# EAGLE design Load_Sig_Sch (EAGLE 6.4)
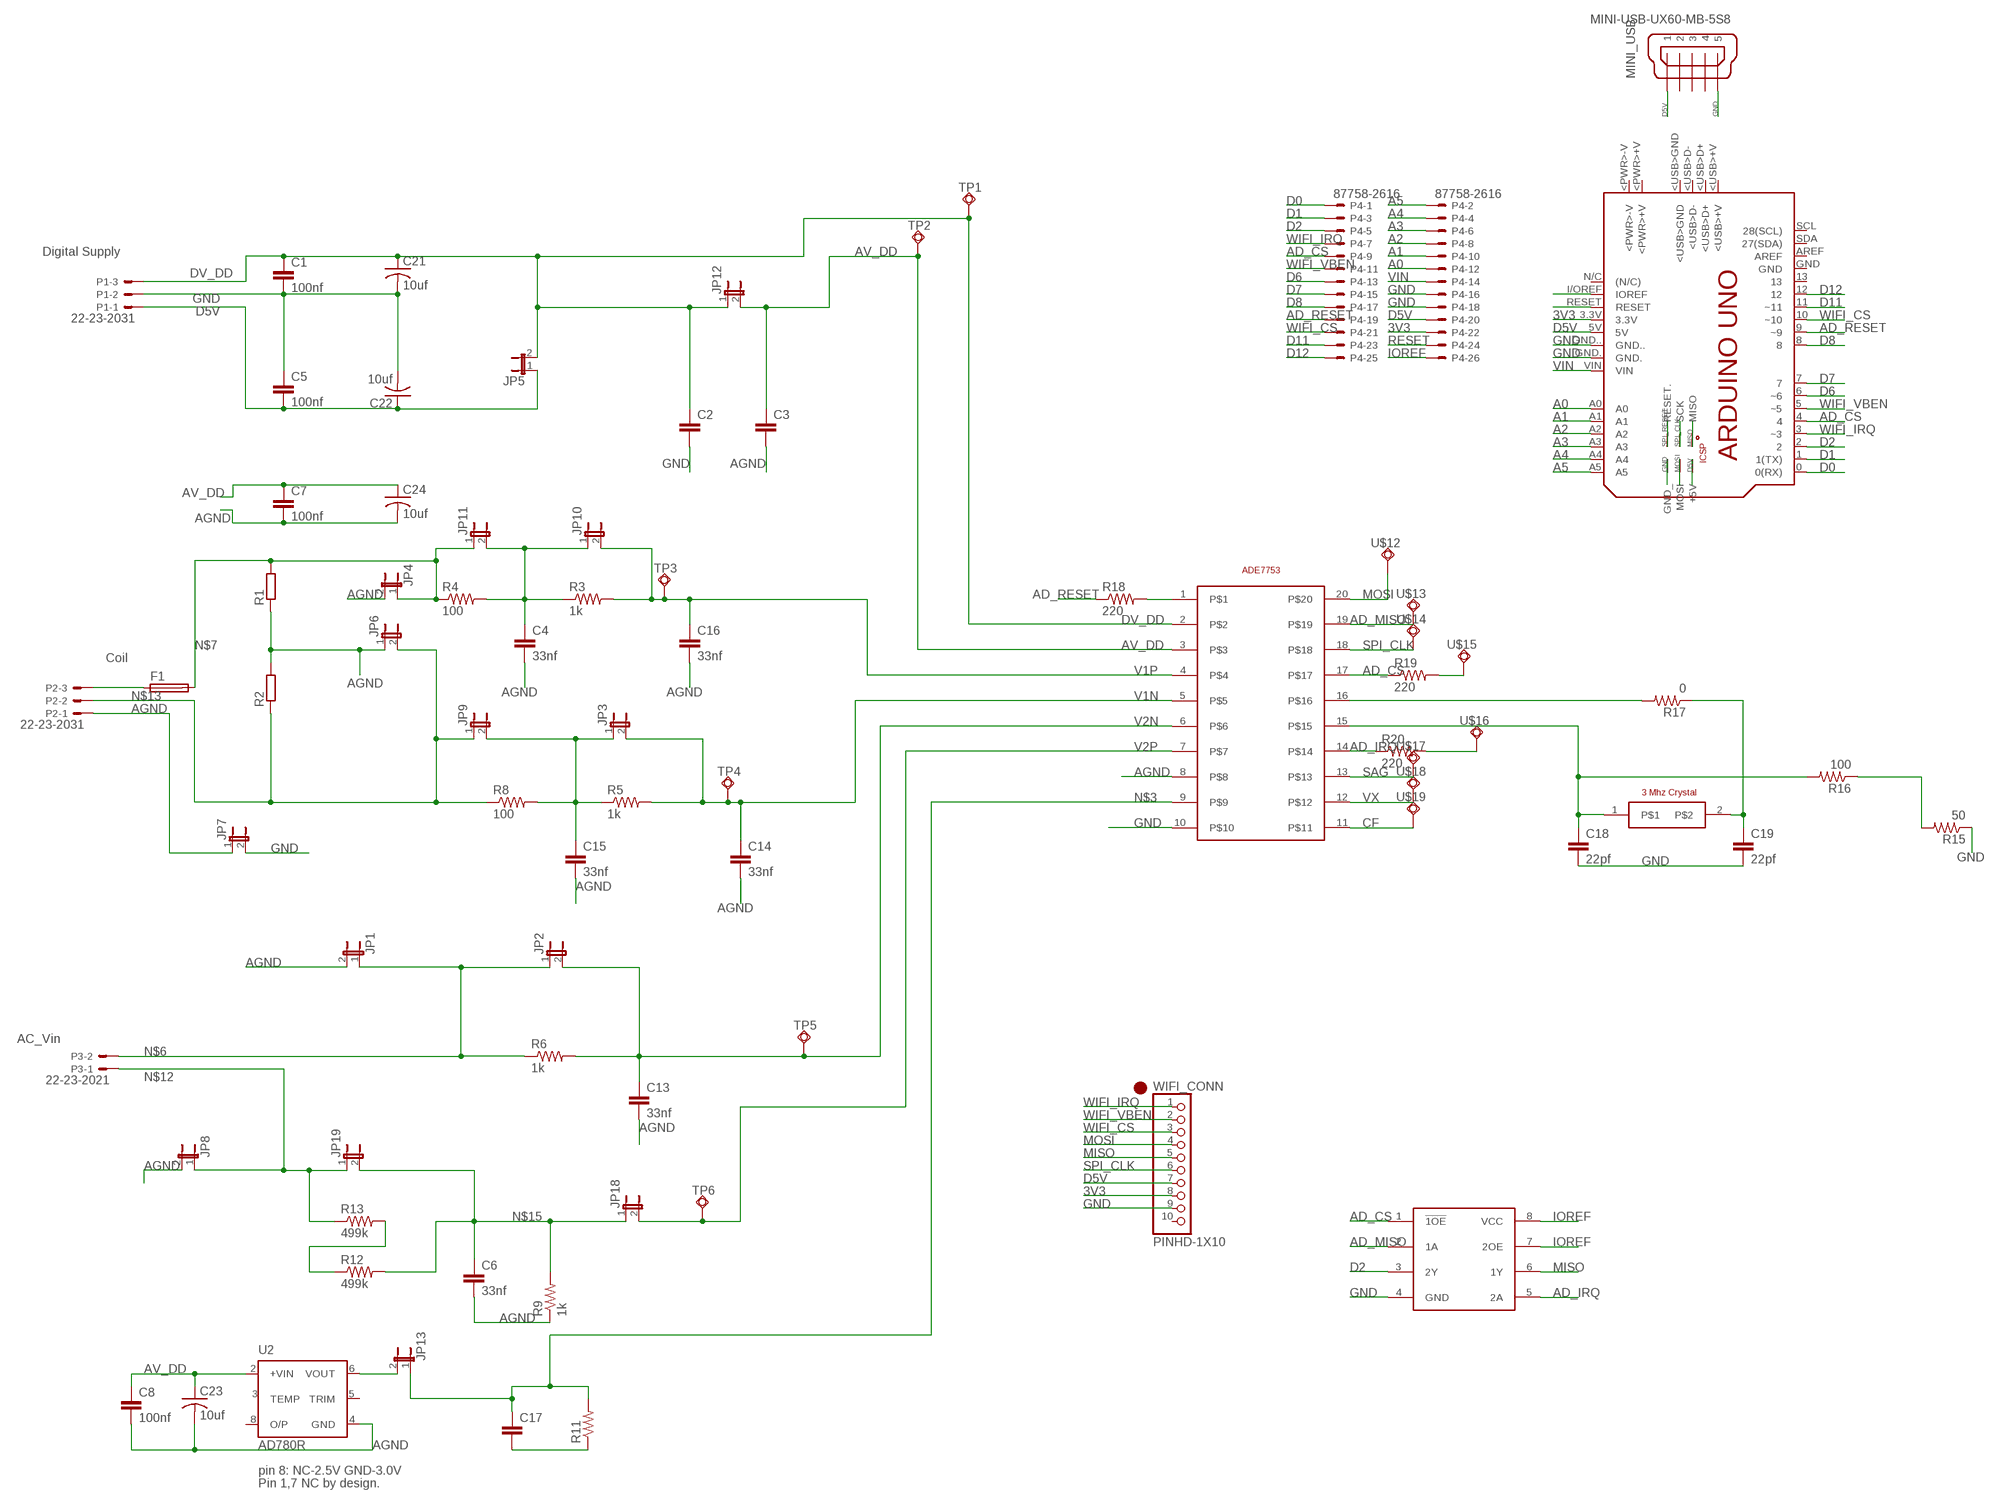
[diagram p0: schematic, sheet 1]

## Parts
C1  100nf  C-EU025-024X044  [C025-024X044]
C2  C-EU025-024X044  [C025-024X044]
C3  C-EU025-024X044  [C025-024X044]
C4  33nf  C-EU025-024X044  [C025-024X044]
C5  100nf  C-EU025-024X044  [C025-024X044]
C6  33nf  C-EU025-024X044  [C025-024X044]
C7  100nf  C-EU025-024X044  [C025-024X044]
C8  100nf  C-EU025-024X044  [C025-024X044]
C13  33nf  C-EU025-024X044  [C025-024X044]
C14  33nf  C-EU025-024X044  [C025-024X044]
C15  33nf  C-EU025-024X044  [C025-024X044]
C16  33nf  C-EU025-024X044  [C025-024X044]
C17  C-EU025-024X044  [C025-024X044]
C18  22pf  C-EU025-024X044  [C025-024X044]
C19  22pf  C-EU025-024X044  [C025-024X044]
C21  10uf  C-US025-024X044  [C025-024X044]
C22  10uf  C-US025-024X044  [C025-024X044]
C23  10uf  C-US025-024X044  [C025-024X044]
C24  10uf  C-US025-024X044  [C025-024X044]
F1  19560  [19560]
JP1  JP1E  [JP1]
JP2  JP1E  [JP1]
JP3  JP1E  [JP1]
JP4  JP1E  [JP1]
JP5  JP1E  [JP1]
JP6  JP1E  [JP1]
JP7  JP1E  [JP1]
JP8  JP1E  [JP1]
JP9  JP1E  [JP1]
JP10  JP1E  [JP1]
JP11  JP1E  [JP1]
JP12  JP1E  [JP1]
JP13  JP1E  [JP1]
JP18  JP1E  [JP1]
JP19  JP1E  [JP1]
MINI_USB  MINI-USB-UX60-MB-5S8  [UX60-MB-5S8]
P1  22-23-2031  [22-23-2031]
P2  22-23-2031  [22-23-2031]
P3  22-23-2021  [22-23-2021]
P4  87758-2616  [87758-2616]
PCB1  ARDUINO_UNO  [ARDUINO_UNO]
R1  BVS  [BVS]
R2  BVS  [BVS]
R3  1k  R-US_0204/2V  [0204V]
R4  100  R-US_0204/2V  [0204V]
R5  1k  R-US_0204/2V  [0204V]
R6  1k  R-US_0204/2V  [0204V]
R8  100  R-US_0204/2V  [0204V]
R9  1k  R-US_0204/2V  [0204V]
R11  R-US_0204/2V  [0204V]
R12  499k  R-US_0204/2V  [0204V]
R13  499k  R-US_0204/2V  [0204V]
R15  50  R-US_0204/2V  [0204V]
R16  100  R-US_0204/2V  [0204V]
R17  0  R-US_0204/2V  [0204V]
R18  220  RESISTOR0603-RES  [0603-RES]
R19  220  RESISTOR0603-RES  [0603-RES]
R20  220  RESISTOR0603-RES  [0603-RES]
TP1  TEST  [TEST]
TP2  TEST  [TEST]
TP3  TEST  [TEST]
TP4  TEST  [TEST]
TP5  TEST  [TEST]
TP6  TEST  [TEST]
U1  ADE7753  [SSOP20]
U2  AD780R  [SO8]
U3  74LVC2G241  [SOP65P490X110-8N]
U$2  X079-ND_CRYSTAL  [HC49US]
U$12  TEST  [TEST]
U$13  TEST  [TEST]
U$14  TEST  [TEST]
U$15  TEST  [TEST]
U$16  TEST  [TEST]
U$17  TEST  [TEST]
U$18  TEST  [TEST]
U$19  TEST  [TEST]
WIFI_CONN  PINHD-1X10  [1X10-BIG]

## Nets
3V3: P4.22 PCB1.3.3V WIFI_CONN.8
A0: P4.12 PCB1.A0
A1: P4.10 PCB1.A1
A2: P4.8 PCB1.A2
A3: P4.6 PCB1.A3
A4: P4.4 PCB1.A4
A5: P4.2 PCB1.A5
AD_CS: P4.9 PCB1.4 R19.1 U1.17 U3.1(!1OE)
AD_IRQ: R20.1 U1.14 U3.5(2A)
AD_MISO: U1.19 U3.2(1A) U$13.1
AD_RESET: P4.19 PCB1.9(~9) R18.1
AGND: C3.2 C4.2 C6.2 C7.2 C8.2 C13.2 C14.2 C15.2 C16.2 C23.2 C24.2 JP1.2 JP4.2 JP6.1 JP7.1 JP8.2 P2.1 R1.2 R2.1 R9.1 U1.8 U2.4(GND)
AV_DD: C3.1 C7.1 C8.1 C23.1 C24.1 JP12.2 TP2.1 U1.3 U2.2(+VIN)
CF: U1.11 U$19.1
D0: P4.1 PCB1.0(0(RX))
D1: P4.3 PCB1.1(1(TX))
D2: P4.5 PCB1.2 U3.3(2Y)
D5V: C5.2 C22.1 JP5.1 MINI_USB.1 P1.1 P4.20 PCB1.5V PCB1.+5V WIFI_CONN.7
D6: P4.13 PCB1.6(~6)
D7: P4.15 PCB1.7
D8: P4.17 PCB1.8
D11: P4.23 PCB1.11(~11)
D12: P4.25 PCB1.12
DV_DD: C1.1 C2.1 C21.1 JP5.2 JP12.1 P1.3 TP1.1 U1.2
GND: C1.2 C2.2 C5.1 C18.2 C19.2 C21.2 C22.2 JP7.2 MINI_USB.5 P1.2 P4.16 P4.18 PCB1.GND. PCB1.GND.. PCB1.GND_ R15.1 U1.10 U3.4(GND) WIFI_CONN.9
IOREF: P4.26 PCB1.I/OREF(IOREF) U3.7(2OE) U3.8(VCC)
MISO: PCB1.MISO U3.6(1Y) WIFI_CONN.5
MOSI: PCB1.MOSI U1.20 U$12.1 WIFI_CONN.4
N$1: F1.1 P2.3
N$3: C17.1 JP13.1 R11.2 U1.9
N$4: C18.1 R16.2 U1.15 U$2.1
N$5: C19.1 R17.1 U$2.2
N$6: JP1.1 JP2.1 P3.2 R6.1
N$7: F1.2 JP4.1 JP11.1 R1.1 R4.1
N$8: C4.1 JP10.1 JP11.2 R3.1 R4.2
N$9: R15.2 R16.1
N$10: C15.1 JP3.1 JP9.2 R5.1 R8.2
N$12: JP8.1 JP19.1 P3.1 R13.1
N$13: JP6.2 JP9.1 P2.2 R2.2 R8.1
N$14: R17.2 U1.16
N$15: C6.1 JP18.1 JP19.2 R9.2 R12.2
N$16: R12.1 R13.2
N$19: JP13.2 U2.6(VOUT)
N$20: C17.2 R11.1
N$21: R19.2 U$15.1
N$22: R20.2 U$16.1
RESET: P4.24 PCB1.RESET
RESETBIN: R18.2 U1.1
SAG: U1.13 U$17.1
SPI_CLK: PCB1.SCK U1.18 U$14.1 WIFI_CONN.6
SPI_RESET: PCB1.RESET.
V1N: C14.1 JP3.2 R5.2 TP4.1 U1.5
V1P: C16.1 JP10.2 R3.2 TP3.1 U1.4
V2N: C13.1 JP2.2 R6.2 TP5.1 U1.6
V2P: JP18.2 TP6.1 U1.7
VIN: P4.14 PCB1.VIN
VX: U1.12 U$18.1
WIFI_CS: P4.21 PCB1.10(~10) WIFI_CONN.3
WIFI_IRQ: P4.7 PCB1.3(~3) WIFI_CONN.1
WIFI_VBEN: P4.11 PCB1.5(~5) WIFI_CONN.2
Unconnected: MINI_USB.2 MINI_USB.3 MINI_USB.4 PCB1.13 PCB1.<PWR>+V PCB1.<PWR>-V PCB1.<USB>+V PCB1.<USB>D+ PCB1.<USB>D- PCB1.<USB>GND PCB1.AREF PCB1.GND PCB1.N/C((N/C)) PCB1.SCL(28(SCL)) PCB1.SDA(27(SDA)) U2.3(TEMP) U2.5(TRIM) U2.8(O/P) WIFI_CONN.10

## Notes on the sheet
- Digital Supply
- Coil
- AC_Vin
- pin 8: NC-2.5V GND-3.0V
- Pin 1,7 NC by design.

## Library data of the parts
C1-C8 C13-C17 = resistor:C-EU: CAPACITOR, European symbol
C18 C19 = rcl:C-EU: CAPACITOR, European symbol
C21-C24 = adafruit:C-US: CAPACITOR, American symbol
F1 = fuse:19560: FUSE HOLDER TR5, Wickmann; MPN: 56000001009; OC_FARNELL: 1185363; OC_NEWARK: 15P8392
JP1-JP13 JP18 JP19 = jumper:JP1E: JUMPER
MINI_USB = con-hirose:MINI-USB-: MINI USB Connector Source: http://www.hirose.co.jp/cataloge_hp/e24000019.pdf; OC_FARNELL: unknown; OC_NEWARK: unknown
P1 P2 = con-molex:22-23-2031: .100" (2.54mm) Center Header - 3 Pin; MF: MOLEX; MPN: 22-23-2031; OC_FARNELL: 1462950; OC_NEWARK: 30C0862
P3 = con-molex:22-23-2021: .100" (2.54mm) Center Header - 2 Pin; MF: MOLEX; MPN: 22-23-2021; OC_FARNELL: 1462926; OC_NEWARK: 25C3832
P4 = con-molex:87758-2616: 26 Pin - 2mm Dual Row Single Wafer, Vertical T/H HDR Source: http://www.molex.com/pdm_docs/sd/877580616_sd.pdf; MPN: 87758-2616; OC_FARNELL: unknown; OC_NEWARK: 94M1541
PCB1 = E14_Arduino_published:ARDUINO_UNO: Device for representing an Arduino Uno board with a footprint in an EAGLE design. Created by Dave Young for Element14. More EAGLE documentation at: http://www.element14.com/community/community/knode/cadsoft_eagle
R1 R2 = resistor-shunt:BVS: SMD SHUNT RESISTOR; OC_FARNELL: unknown; OC_NEWARK: unknown
R3-R6 R8 R9 R11-R13 R15-R17 = adafruit:R-US_: RESISTOR, American symbol
R18-R20 = SparkFun-Passives:RESISTOR: Resistor Basic schematic elements and footprints for 0603, 1206, and PTH resistors.
TP1-TP6 U$12-U$19 = CALPLUG:TEST
U1 = untitled:ADE7753
U2 = analog-devices:AD780: High Precision Reference 2.5V/3.0V Source: http://www.analog.com/UploadedFiles/Data_Sheets/AD780.pdf; MPN: AD780BRZ-REEL; OC_FARNELL: 1464655; OC_NEWARK: 12M8938
U3 = 74LVC2G241:74LVC2G241: Tri-state buffer
U$2 = untitled:X079-ND_CRYSTAL
WIFI_CONN = adafruit:PINHD-1X10: Pin header 1x10 0.1" spacing With round pins

## Board
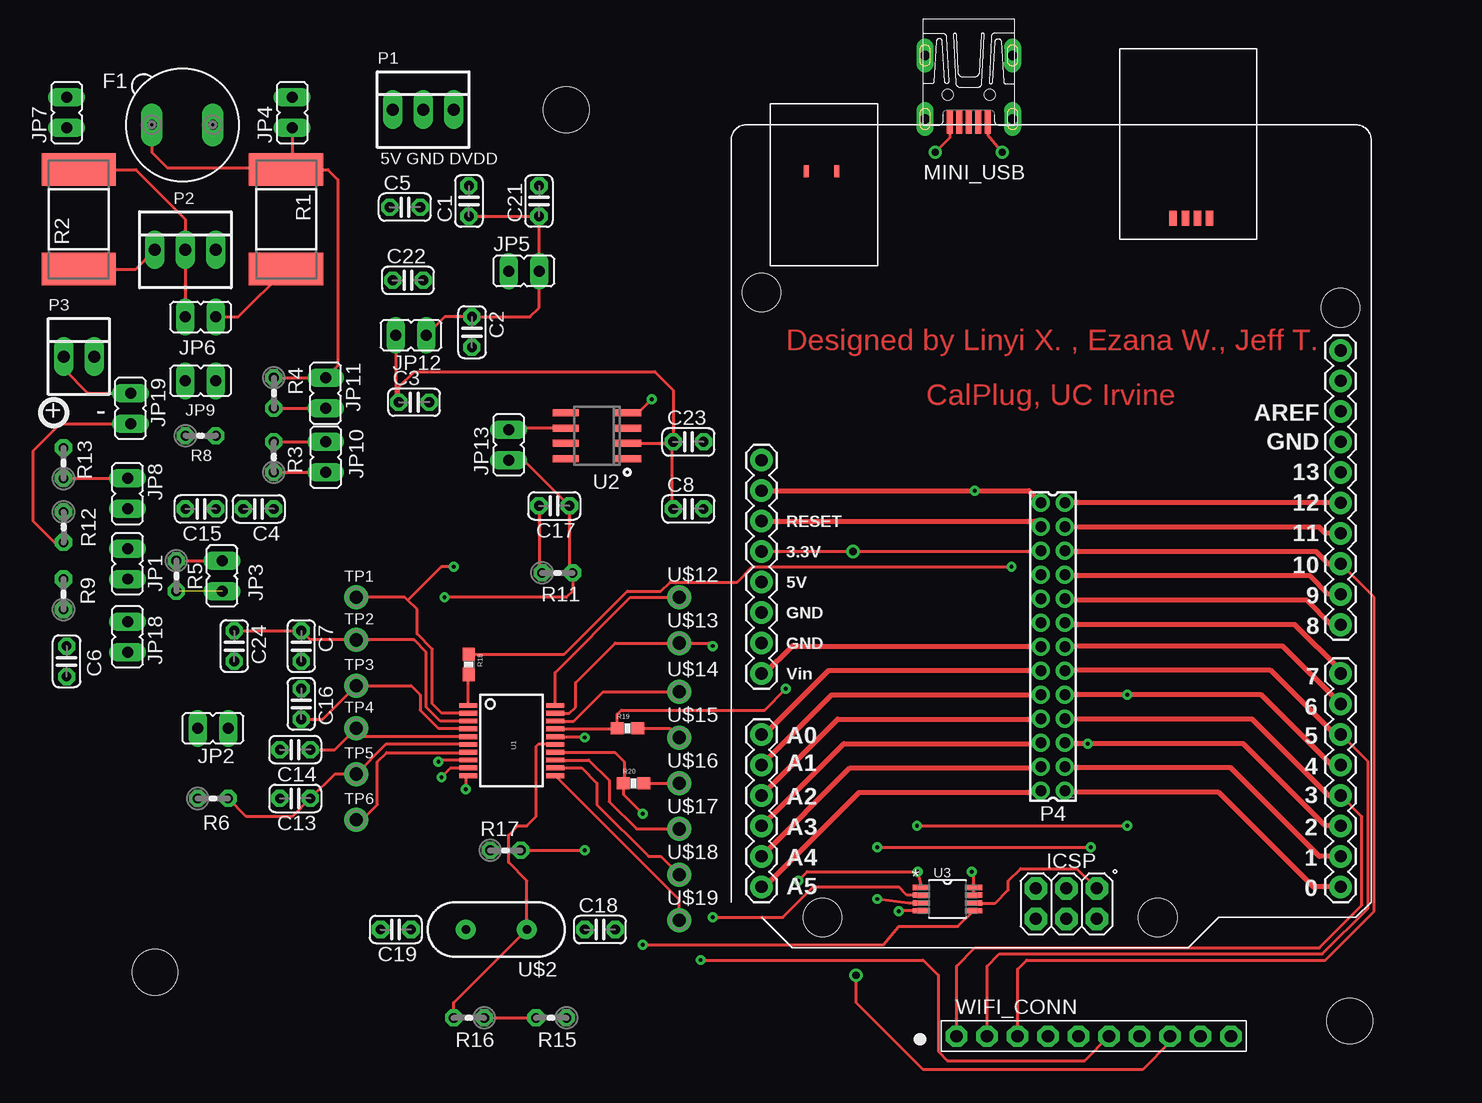
[diagram p1: board, top side]
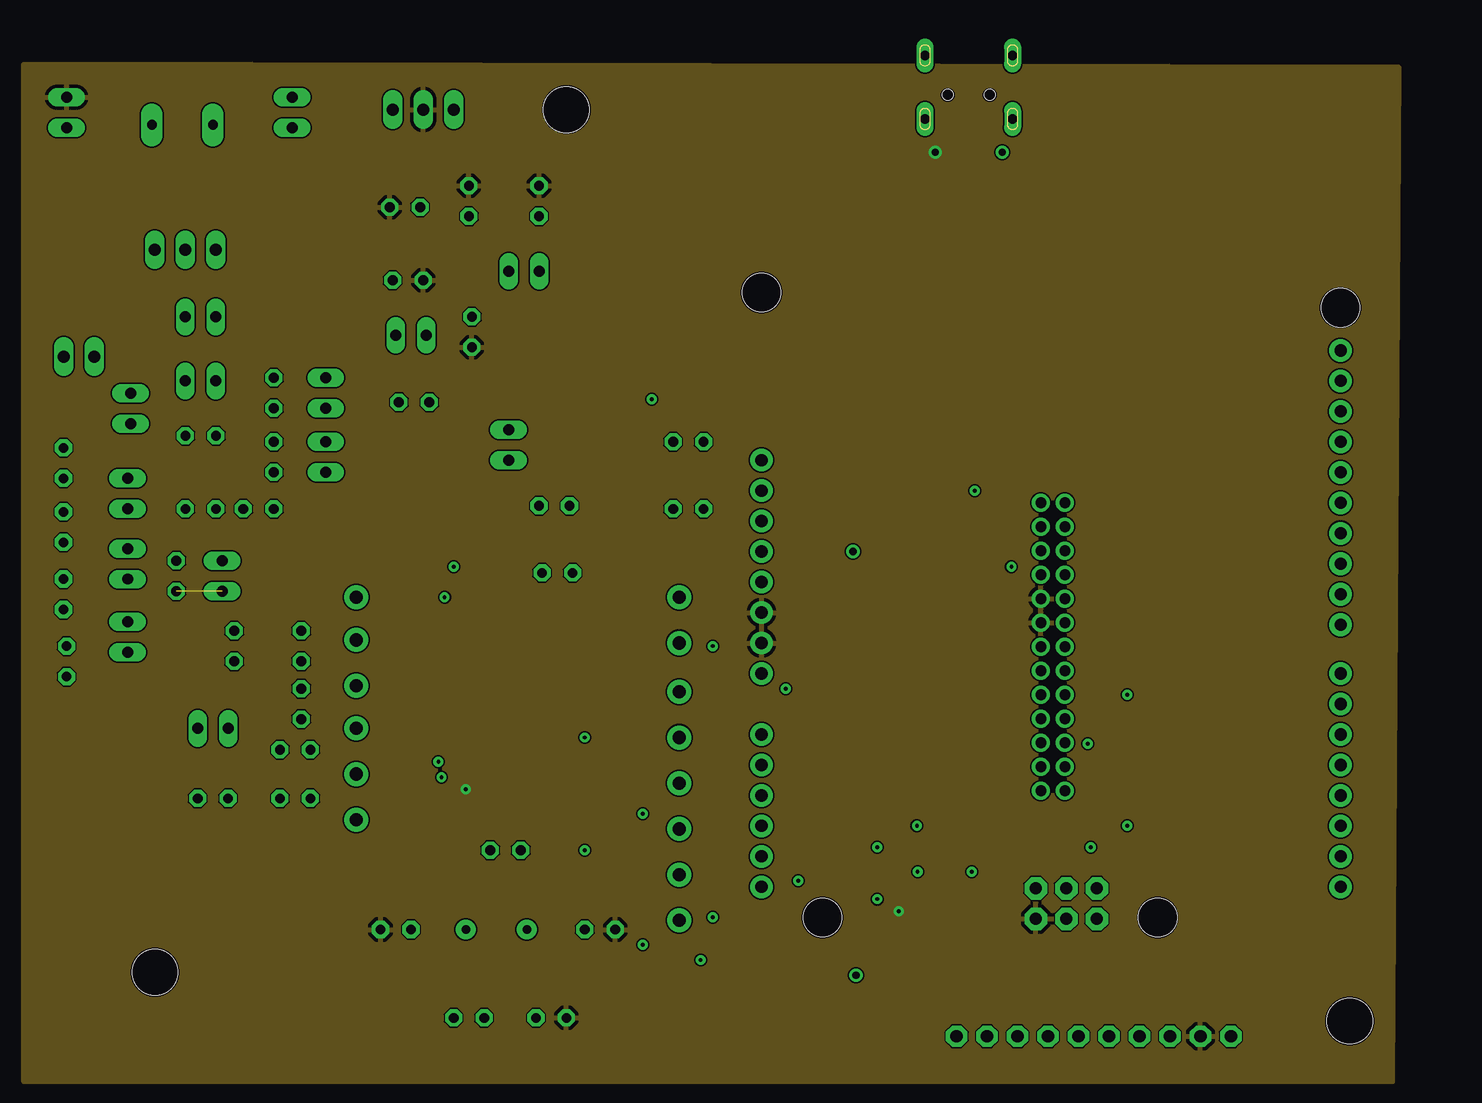
[diagram p2: board, inner layer Route2]
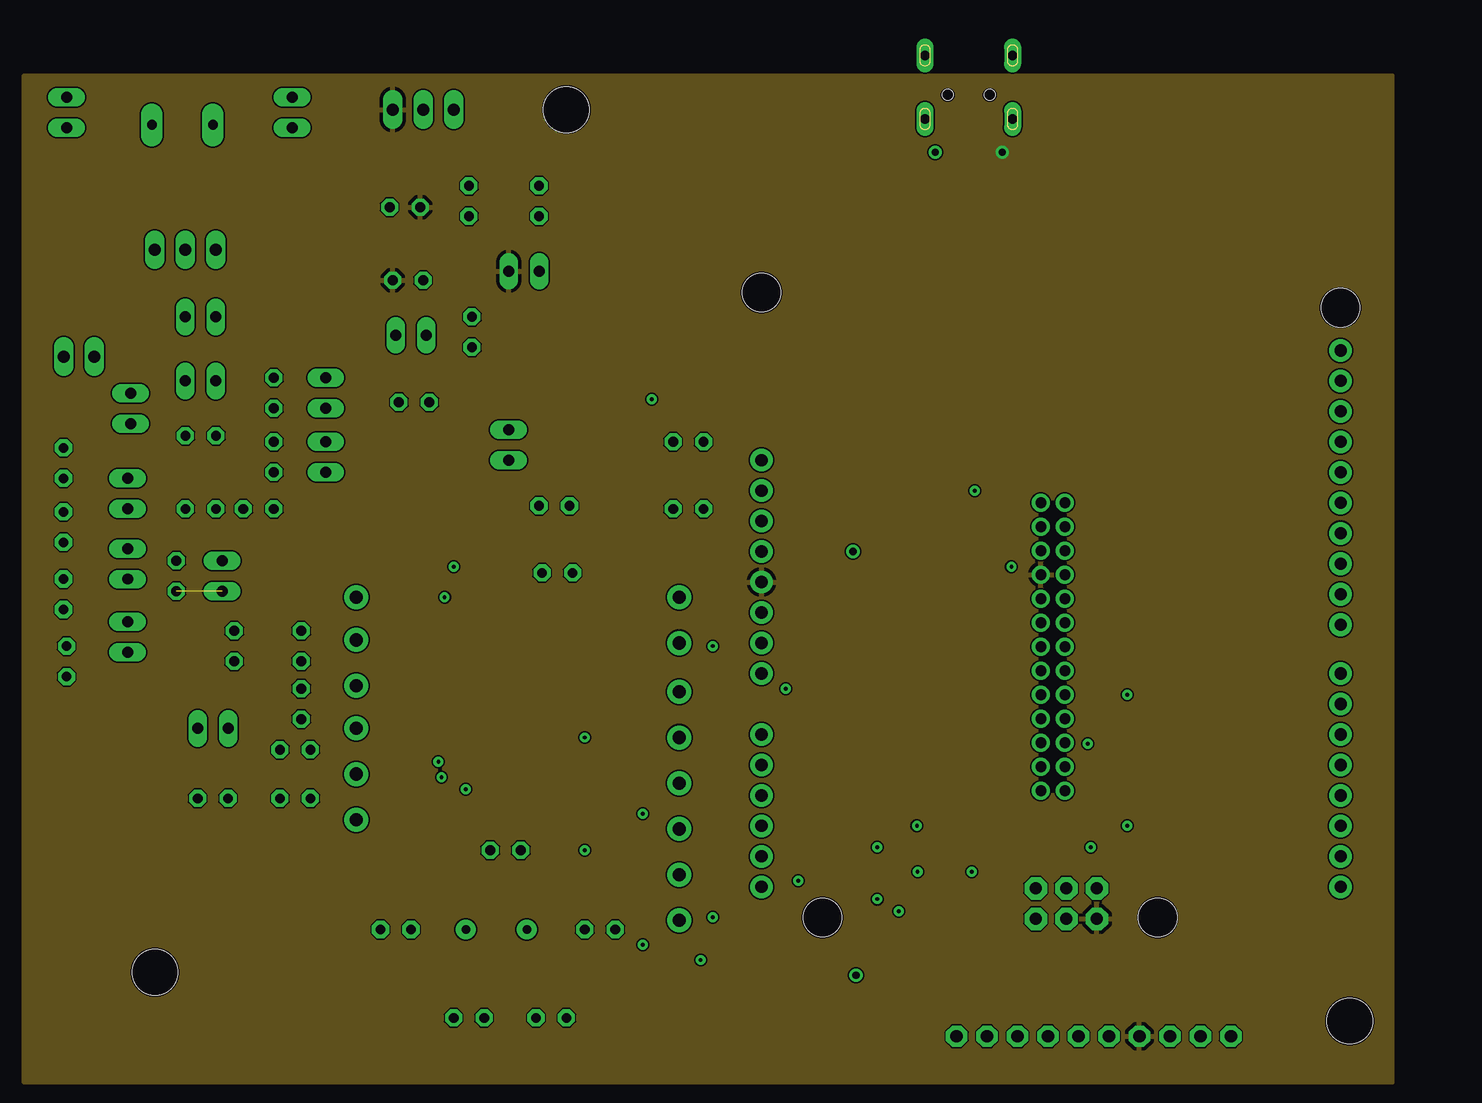
[diagram p3: board, inner layer Route15]
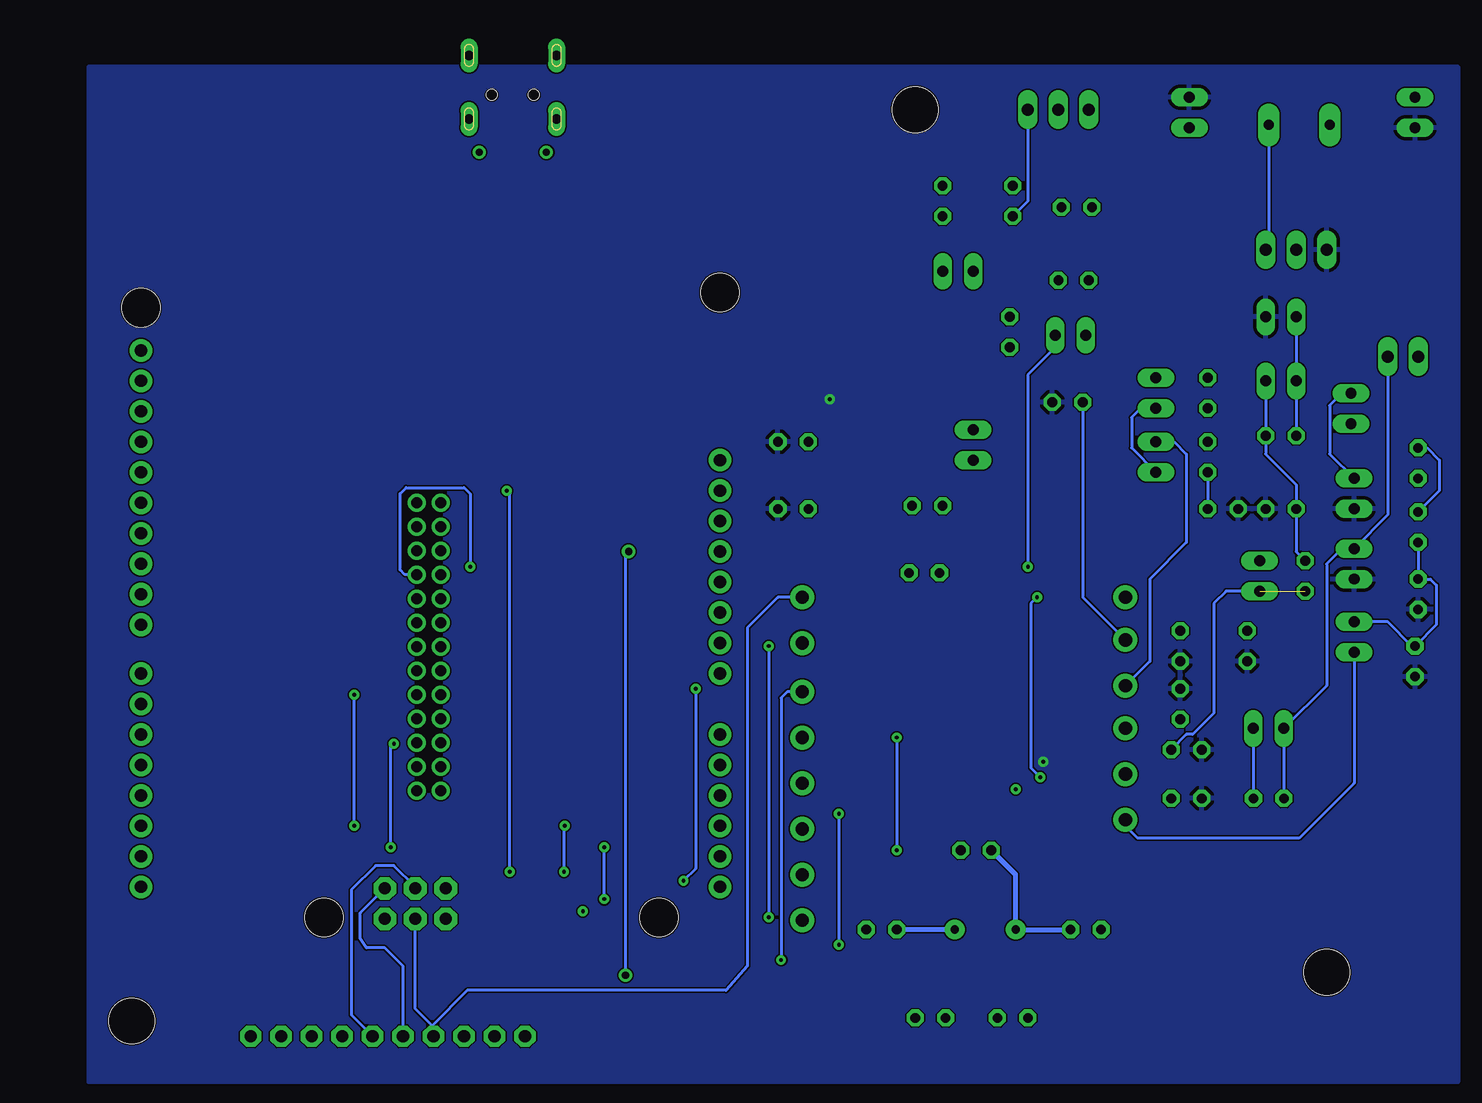
[diagram p4: board, bottom side, seen from below]

No outline drawn. Coordinates in mm, seen from the top.
Copper layers (1*2*15*16): Top 0.035mm / dielectric 1.5mm / Route2 0.035mm / dielectric 0.15mm / Route15 0.035mm / dielectric 0.2mm / Bottom 0.035mm
Design rules "SparkFun-4-layer *": minimum track width 5mil, minimum drill 10mil, track to track 5mil, track to pad 5mil, pad to pad 5mil, via to via 5mil, smd to smd 5mil, copper to edge 5mil, drill to drill 8mil, minimum pad ring 12mil, minimum via ring 10mil, stop-mask expansion 4mil, vias tented up to drill 20mil, thermal gap 12mil
Holes 3.81 mm at 12.45,10.41 112.01,6.35 46.74,82.3

### Footprints (pad centres in the part's own frame; a part is rotated, then mirrored left to right if it is on the bottom)
C025-024X044 = drill 0.813 octagon: 1 -1.27,0; 2 1.27,0
C025-024X044' = drill 0.813 pad 1.422 octagon: 1 -1.27,0; 2 1.27,0
19560 = drill 0.813 pad 1.778 long: 1 -2.54,0; 2 2.54,0
JP1 = drill 0.914 long: 1 0,-1.27; 2 0,1.27
UX60-MB-5S8 = smd 2 x 0.5: 1 8.65,1.6; 2 8.65,0.8; 3 8.65,0; 4 8.65,-0.8; 5 8.65,-1.6 | drill 0.8 long: M1 3.1,-3.65; M2 3.1,3.65; M3 8.4,3.65; M4 8.4,-3.65 | hole 0.9: 6.4,-1.75; 6.4,1.75
22-23-2031 = drill 1 long: 1 -2.54,0; 2 0,0; 3 2.54,0
22-23-2021 = drill 1 long: 1 -1.27,0; 2 1.27,0
87758-2616 = drill 0.9 pad 1.27: 1 -12,-1; 2 -12,1; 3 -10,-1; 4 -10,1; 5 -8,-1; 6 -8,1; 7 -6,-1; 8 -6,1; 9 -4,-1; 10 -4,1; 11 -2,-1; 12 -2,1; 13 0,-1; 14 0,1; 15 2,-1; 16 2,1; 17 4,-1; 18 4,1; 19 6,-1; 20 6,1; 21 8,-1; 22 8,1; 23 10,-1; 24 10,1; 25 12,-1; 26 12,1
ARDUINO_UNO = drill 1.016 pad 1.88: 0 63.5,50.8; 1 60.96,50.8; 2 58.42,50.8; 3 55.88,50.8; 3.3V 35.56,2.54; 4 53.34,50.8; 5 50.8,50.8; 5V 38.1,2.54; 6 48.26,50.8; 7 45.72,50.8; 8 41.656,50.8; 9 39.116,50.8; 10 36.576,50.8; 11 34.036,50.8; 12 31.496,50.8; 13 28.956,50.8; A0 50.8,2.54; A1 53.34,2.54; A2 55.88,2.54; A3 58.42,2.54; A4 60.96,2.54; A5 63.5,2.54; AREF 23.876,50.8; GND 26.416,50.8; GND. 43.18,2.54; GND.. 40.64,2.54; I/OREF 30.48,2.54; N/C 27.94,2.54; RESET 33.02,2.54; SCL 18.796,50.8; SDA 21.336,50.8; VIN 45.72,2.54 | drill 1.016 pad 1.88 octagon: +5V 66.167,30.48; GND_ 66.167,25.4; MISO 63.627,30.48; MOSI 66.167,27.94; RESET. 63.627,25.4; SCK 63.627,27.94 | smd 1.016 x 0.508: <PWR>+V 3.861,8.814; <PWR>-V 3.861,6.274 | smd 1.27 x 0.635: <USB>+V 7.772,39.878; <USB>D+ 7.772,38.887; <USB>D- 7.772,37.871; <USB>GND 7.772,36.83 | hole 3.2: 66.04,7.62; 66.04,35.56; 15.24,50.8; 13.97,2.54
BVS = smd 2.7 x 6.2: 1 -4.14,0; 2 4.14,0
0204V = drill 0.813 octagon: 1 -1.27,0; 2 1.27,0
0603-RES = smd 1.1 x 1: 1 -0.85,0; 2 0.85,0
TEST = drill 1.1 pad 2: 1 0,0
SSOP20 = smd 0.4 x 1.5: 1 -2.925,-3.625; 2 -2.275,-3.625; 3 -1.625,-3.625; 4 -0.975,-3.625; 5 -0.325,-3.625; 6 0.325,-3.625; 7 0.975,-3.625; 8 1.625,-3.625; 9 2.275,-3.625; 10 2.925,-3.625; 11 2.925,3.625; 12 2.275,3.625; 13 1.625,3.625; 14 0.975,3.625; 15 0.325,3.625; 16 -0.325,3.625; 17 -0.975,3.625; 18 -1.625,3.625; 19 -2.275,3.625; 20 -2.925,3.625
SO8 = smd 0.6 x 2.2: 1 -1.905,-2.6; 2 -0.635,-2.6; 3 0.635,-2.6; 4 1.905,-2.6; 5 1.905,2.6; 6 0.635,2.6; 7 -0.635,2.6; 8 -1.905,2.6
SOP65P490X110-8N = smd 1.422 x 0.432: 1 -2.184,0.965; 2 -2.184,0.33; 3 -2.184,-0.33; 4 -2.184,-0.965; 5 2.184,-0.965; 6 2.184,-0.33; 7 2.184,0.33; 8 2.184,0.965
HC49US = drill 0.7 pad 1.651: 1 -2.54,0; 2 2.54,0
1X10-BIG = drill 1.016 pad 1.778 octagon: 1 -11.43,0; 2 -8.89,0; 3 -6.35,0; 4 -3.81,0; 5 -1.27,0; 6 1.27,0; 7 3.81,0; 8 6.35,0; 9 8.89,0; 10 11.43,0

### Placement (x,y rotation side)
C1  38.61,74.68 90 top
C2  38.86,63.75 270 top
C3  34.04,57.91 0 top
C4  21.08,49.02 180 top
C5  33.27,74.17 0 top
C6  5.08,36.32 270 top
C7  24.64,37.59 270 top
C8  56.9,49.02 0 top
C13  24.13,24.89 180 top
C14  24.13,28.96 180 top
C15  16.26,49.02 0 top
C16  24.64,32.77 90 top
C17  45.72,49.28 180 top
C18  49.53,13.97 0 top
C19  32.51,13.97 180 top
C21  10uf  [C025-024X044']  44.45,74.68 90 top
C22  10uf  [C025-024X044']  33.53,68.07 0 top
C23  10uf  [C025-024X044']  56.9,54.61 0 top
C24  10uf  [C025-024X044']  19.05,37.59 270 top
F1  14.73,81.03 180 top
JP1  10.16,44.45 180 top
JP2  17.27,30.73 270 top
JP3  18.03,43.43 180 top
JP4  23.88,82.04 0 top
JP5  43.18,68.83 270 top
JP6  16.26,65.02 90 top
JP7  5.08,82.04 0 top
JP8  10.16,50.29 180 top
JP9  16.26,59.69 270 top
JP10  26.67,53.34 0 top
JP11  26.67,58.67 180 top
JP12  33.78,63.5 90 top
JP13  41.91,54.36 0 top
JP18  10.16,38.35 180 top
JP19  10.41,57.4 180 top
MINI_USB  80.26,89.92 270 top
P1  34.8,82.3 0 top
P2  14.99,70.61 0 top
P3  6.1,61.72 0 top
P4  87.27,37.54 90 top
PCB1  60.45,81.03 270 top
R1  23.37,73.15 270 top
R2  6.1,73.15 90 top
R3  22.35,53.34 90 top
R4  22.35,58.67 270 top
R5  14.22,43.43 270 top
R6  17.27,24.89 0 top
R8  16.26,55.12 0 top
R9  4.83,41.91 90 top
R11  45.97,43.69 0 top
R12  4.83,47.5 270 top
R13  4.83,52.83 90 top
R15  45.47,6.6 180 top
R16  38.61,6.6 180 top
R17  41.66,20.57 0 top
R18  38.61,36.07 270 top
R19  51.82,30.73 0 top
R20  52.32,26.16 0 top
TP1  29.21,41.66 0 top
TP2  29.21,38.1 0 top
TP3  29.21,34.29 0 top
TP4  29.21,30.73 0 top
TP5  29.21,26.92 0 top
TP6  29.21,23.11 0 top
U1  42.16,29.72 270 top
U2  49.28,55.12 90 top
U3  78.49,16.51 0 top
U$2  40.89,13.97 180 top
U$12  56.13,41.66 0 top
U$13  56.13,37.85 0 top
U$14  56.13,33.78 0 top
U$15  56.13,29.97 0 top
U$16  56.13,26.16 0 top
U$17  56.13,22.35 0 top
U$18  56.13,18.54 0 top
U$19  56.13,14.73 0 top
WIFI_CONN  90.68,5.08 0 top

### Tracks (layer width: path | path; a pad name or v marks a point on that pad's centre or on a via)
3V3  (via drill 0.6)
  Top 0.254: 86.2,45.47 v70.61,45.47 PCB1.3.3V | WIFI_CONN.8 97.03,4.57 94.74,2.29 76.45,2.29 70.87,7.87 v70.87,10.16
  Top 0.406: 86.2,45.47 P4.22
  Bottom 0.254: v70.87,10.16 70.87,45.21 v70.61,45.47
A0
  Top 0.406: PCB1.A0 63.25,30.23 68.58,35.56 86.26,35.56 P4.12
A1
  Top 0.406: PCB1.A1 68.83,33.53 86.26,33.53 P4.10
A2
  Top 0.406: PCB1.A2 69.34,31.5 86.23,31.5 P4.8
A3
  Top 0.406: PCB1.A3 69.85,29.46 86.2,29.46 P4.6
A4
  Top 0.406: PCB1.A4 70.36,27.43 86.17,27.43 P4.4
A5
  Top 0.406: PCB1.A5 63.25,17.53 71.12,25.4 86.13,25.4 P4.2
AD_CS  (via drill 0.32)
  Top 0.254: U1.17 50.92,30.69 R19.1 50.97,31.92 51.31,32.26 63.25,32.26 v65.02,34.04 | v66.04,18.03 66.8,18.8 v76,18.8 U3.1 | v75.95,22.61 v93.47,22.61
  Top 0.406: PCB1.4 110.49,27.69 104.65,33.53 v93.47,33.53 88.29,33.53 P4.9
  Bottom 0.254: v65.02,34.04 65.02,19.05 v66.04,18.03 | v93.47,22.61 v93.47,33.53 | v76,18.8 76,22.55 v75.95,22.61
AD_IRQ  (via drill 0.32)
  Top 0.254: U1.14 45.83,28.7 50.8,28.7 51.56,27.94 51.56,26.25 R20.1 51.47,25.23 v53.09,23.62 | v53.09,12.7 73.15,12.7 74.42,14.22 79.35,14.22 U3.5
  Bottom 0.254: v53.09,23.62 v53.09,12.7
AD_MISO  (via drill 0.32)
  Top 0.254: U1.19 46.98,31.99 47.5,32.51 47.5,34.54 50.8,37.85 U$13.1 58.67,37.85 v58.93,37.59 | U3.2 75.11,16.84 74.42,17.53 67.31,17.53 64.77,14.99 v58.93,14.99
  Bottom 0.254: v58.93,37.59 v58.93,14.99
AD_RESET  (via drill 0.32)
  Top 0.254: R18.1 46.57,36.92 51.82,42.16 54.61,42.16 55.37,42.93 60.96,42.93 62.23,44.2 v83.82,44.2
  Top 0.406: PCB1.9 110.24,41.91 108.71,43.43 88.38,43.43 P4.19
  Bottom 0.254: P4.19 89.26,43.54 89.66,43.94 89.66,50.29 89.15,50.8 84.33,50.8 83.82,50.29 v83.82,44.2
AGND  (via drill 0.32)
  Top 0.254: U1.8 36.22,28.09 v36.07,27.94 | U2.4 52.7,57.02 v53.85,58.17 | R2.1 10.85,69.01 P2.1 | JP6.1 19.38,65.02 R1.2
  pour Bottom: 1.52,1.27 115.57,1.27 115.57,85.85 1.52,85.85
AV_DD
  Top 0.254: U1.3 36.22,31.34 35.05,32.51 35.05,37.08 34.04,38.1 TP2.1 25.4,38.1 C7.1 C24.1 | U2.2 55.5,54.48 | 55.5,54.48 C23.1 55.63,58.93 54.1,60.45 34.04,60.45 32.77,59.18 C3.1 32.51,58.42 JP12.2 | 55.5,54.48 55.5,49.15 C8.1
  Bottom 0.254: C3.1 32.77,41.66 TP2.1
CF
  Top 0.254: U$19.1 56.13,16.45 U1.11
D0
  Top 0.406: PCB1.0 108.97,17.53 101.09,25.4 88.42,25.4 P4.1
D1
  Top 0.406: PCB1.1 109.47,20.07 102.11,27.43 88.38,27.43 P4.3
D2  (via drill 0.32)
  Top 0.254: U3.3 75.26,16.18 v72.64,16.51 | v72.64,20.83 v90.42,20.83
  Top 0.406: PCB1.2 109.98,22.61 103.12,29.46 v90.17,29.46 88.35,29.46 P4.5
  Bottom 0.254: v72.64,16.51 v72.64,20.83 | v90.42,20.83 90.42,29.21 v90.17,29.46
D5V  (via drill 0.6)
  Top 0.254: MINI_USB.1 81.86,80.19 v83.06,78.74
  pour Route15: 1.52,85.09 1.52,1.27 115.57,1.27 115.57,85.09
D6
  Top 0.406: PCB1.6 106.43,37.59 88.33,37.59 P4.13
D7
  Top 0.406: PCB1.7 111.25,35.56 107.44,39.37 88.45,39.37 P4.15
D8
  Top 0.406: PCB1.8 110.49,39.37 108.46,41.4 88.41,41.4 P4.17
D11
  Top 0.406: PCB1.11 109.98,46.99 109.47,47.5 88.32,47.5 P4.23
D12
  Top 0.406: PCB1.12 88.29,49.53 P4.25
DV_DD  (via drill 0.32)
  Top 0.254: U1.2 36.33,31.99 35.56,32.77 35.56,37.34 34.29,38.61 34.29,40.64 33.53,41.4 | 33.53,41.4 33.27,41.66 TP1.1 | C1.1 C21.1 JP5.2 44.45,65.79 43.69,65.02 C2.1 36.58,65.02 JP12.1 | v37.34,44.2 36.32,44.2 33.53,41.4
  Bottom 0.254: P1.3 37.34,74.68 C1.1 | JP12.1 35.05,62.48 37.34,60.2 v37.34,44.2
GND  (via drill 0.32, 0.6)
  Top 0.254: U1.10 38.35,26.79 v38.35,25.65 | U3.4 74.47,15.54 v74.42,15.49 | MINI_USB.5 78.66,79.93 v77.47,78.74
  pour Route2: 1.52,86.11 116.08,85.85 115.57,1.27 1.52,1.27
IOREF  (via drill 0.32)
  Top 0.254: U3.7 U3.8 80.67,18.64 v80.52,18.8
  Top 0.406: PCB1.I/OREF v80.77,50.55 85.27,50.55 P4.26
  Bottom 0.254: v80.52,18.8 80.52,50.29 v80.77,50.55
MISO
  Top 0.254: U3.6 82.47,16.18 83.57,17.27 83.57,18.03 84.58,19.05 89.28,19.05 PCB1.MISO
  Bottom 0.254: WIFI_CONN.5 89.41,10.92 90.93,12.45 92.46,12.45 92.96,13.21 92.96,15.37 PCB1.MISO
MOSI
  Top 0.254: U1.20 45.79,35.38 52.07,41.66 U$12.1
  Bottom 0.254: WIFI_CONN.4 86.87,5.84 87,5.97 | 87,5.97 88.39,7.37 PCB1.MOSI | U$12.1 58.17,41.66 60.71,39.12 60.71,10.92 62.48,8.89 84.07,8.89 87,5.97
N$1
  Bottom 0.254: F1.1 17.27,70.87 P2.3
N$3  (via drill 0.32)
  Top 0.254: JP13.1 43.18,53.09 C17.1 46.99,43.94 R11.2 47.24,42.16 46.74,41.66 v36.58,41.66 | v36.32,26.67 37.08,27.43 38.53,27.43 U1.9
  Bottom 0.254: v36.58,41.66 37.08,41.15 37.08,27.43 v36.32,26.67
N$4
  Top 0.254: U1.15 44.38,29.39 44.2,29.21 44.2,23.37 43.43,22.61 42.67,22.61 41.91,21.84 41.91,19.56 43.43,18.03 U$2.1 37.34,7.87 R16.2
  Bottom 0.406: U$2.1 C18.1
N$5
  Bottom 0.406: R17.1 38.35,18.54 U$2.2 C19.1
N$6
  Bottom 0.254: R6.1 JP2.1 12.45,34.29 12.45,44.45 11.18,45.72 JP1.1 7.37,48.51 P3.2
N$7
  Top 0.254: R4.1 JP11.1 27.69,60.96 27.69,76.45 26.85,77.29 R1.1 | JP4.1 23.88,77.8 R1.1 | F1.2 12.19,78.74 13.46,77.47 23.19,77.47 R1.1
N$8
  Top 0.254: R3.1 JP10.1 | R4.2 JP11.2
  Bottom 0.254: R3.1 C4.1 | JP11.2 27.94,57.4 28.7,56.64 28.7,54.1 JP10.1
N$9
  Top 0.254: R16.1 R15.2
N$10
  Top 0.254: R5.1 JP3.1
  Bottom 0.254: JP9.2 R8.2 17.53,53.59 14.99,51.05 C15.1 14.99,45.47 R5.1
N$12
  Top 0.254: P3.1 4.83,60.71 6.86,58.67 JP19.1 | R13.1 JP8.1
  Bottom 0.254: JP19.1 11.18,58.67 12.19,57.66 12.19,53.59 JP8.1
N$13
  Top 0.254: R2.2 10.85,77.29 14.99,73.15 P2.2 JP6.2
  Bottom 0.254: JP6.2 JP9.1 R8.1
N$14  (via drill 0.32)
  Top 0.254: U1.16 48.19,30.04 v48.26,29.97 | R17.2 v48.26,20.57
  Bottom 0.254: v48.26,29.97 v48.26,20.57
N$15
  Top 0.254: R12.2 4.06,46.23 2.29,48.01 2.29,53.85 4.57,56.13 JP19.2
  Bottom 0.254: R12.2 R9.2 3.81,43.18 3.3,42.67 3.3,39.37 C6.1 5.33,37.59 7.37,39.62 JP18.1
N$16
  Bottom 0.254: R13.2 4.06,54.1 3.05,53.09 3.05,50.55 R12.1
N$19
  Top 0.254: U2.6 42.04,55.75 JP13.2
N$20
  Top 0.254: C17.2 44.45,43.94 R11.1
N$21
  Top 0.254: R19.2 55.37,30.73 U$15.1
N$22
  Top 0.254: R20.2 U$16.1
RESET
  Top 0.406: PCB1.RESET 85.81,48.01 P4.24
RESETBIN
  Top 0.254: U1.1 38.54,35.15 R18.2
SAG
  Top 0.254: U1.13 48.62,28.09 50.29,26.42 50.29,24.64 52.58,22.35 U$17.1
SPI_CLK  (via drill 0.32)
  Top 0.254: U1.18 47.34,31.34 49.78,33.78 U$14.1 | v57.91,11.43 76.45,11.43 77.72,10.16 77.72,3.81 78.49,3.05 89.92,3.05 WIFI_CONN.6
  Bottom 0.254: PCB1.SCK 88.39,17.53 90.17,19.3 91.69,19.3 93.73,17.27 93.73,6.86 WIFI_CONN.6 | U$14.1 57.4,33.78 57.91,33.27 v57.91,11.43
V1N  (1 unrouted)
  Top 0.254: U1.5 29.9,30.04 TP4.1 27.43,28.96 C14.1
  Bottom 0.254: JP3.2 20.83,42.16 21.84,41.15 21.84,32 23.62,30.23 24.13,30.23 C14.1
V1P
  Top 0.254: U1.4 38.5,30.73 36.07,30.73 34.54,32.26 34.54,33.53 33.78,34.29 TP3.1 26.42,31.5 C16.1 | R3.2 JP10.2
  Bottom 0.254: 26.92,54.61 JP10.2 25.15,54.61 24.13,53.59 24.13,46.23 27.18,43.18 27.18,36.32 TP3.1
V2N
  Top 0.254: U1.6 31.68,29.39 TP5.1 27.43,26.92 C13.1 23.88,23.37 20.07,23.37 R6.2
  Bottom 0.254: JP2.2 R6.2
V2P
  Top 0.254: TP6.1 29.72,23.11 30.99,24.38 30.99,27.94 31.75,28.7 38.5,28.7 U1.7
  Bottom 0.254: JP18.2 10.16,26.16 14.73,21.59 28.19,21.59 29.72,23.11 TP6.1
VIN
  Top 0.406: PCB1.VIN 63.25,35.31 65.53,37.59 86.22,37.59 P4.14
VX
  Top 0.254: U1.12 47.99,27.44 49.28,26.16 49.28,24.38 53.59,20.07 54.61,20.07 U$18.1
WIFI_CS
  Top 0.254: WIFI_CONN.3 84.33,10.67 85.09,11.43 109.98,11.43 114.05,15.49 114.05,41.66 PCB1.10
  Top 0.406: PCB1.10 110.24,44.45 109.22,45.47 88.35,45.47 P4.21
WIFI_IRQ
  Top 0.254: WIFI_CONN.1 79.25,10.92 80.77,12.45 109.47,12.45 113.03,16 113.03,23.37 PCB1.3
  Top 0.406: PCB1.3 110.24,25.15 103.89,31.5 88.32,31.5 P4.7
WIFI_VBEN
  Top 0.254: WIFI_CONN.2 81.79,10.92 82.8,11.94 109.73,11.94 113.54,15.75 113.54,27.94 PCB1.5
  Top 0.406: PCB1.5 110.74,30.23 105.41,35.56 88.29,35.56 P4.11

### Text on the board
Top: Designed by Linyi X. , Ezana W., Jeff T. | CalPlug, UC Irvine
tNames: 5V GND DVDD | + -